# EAGLE schematic test (EAGLE 9.4.2)
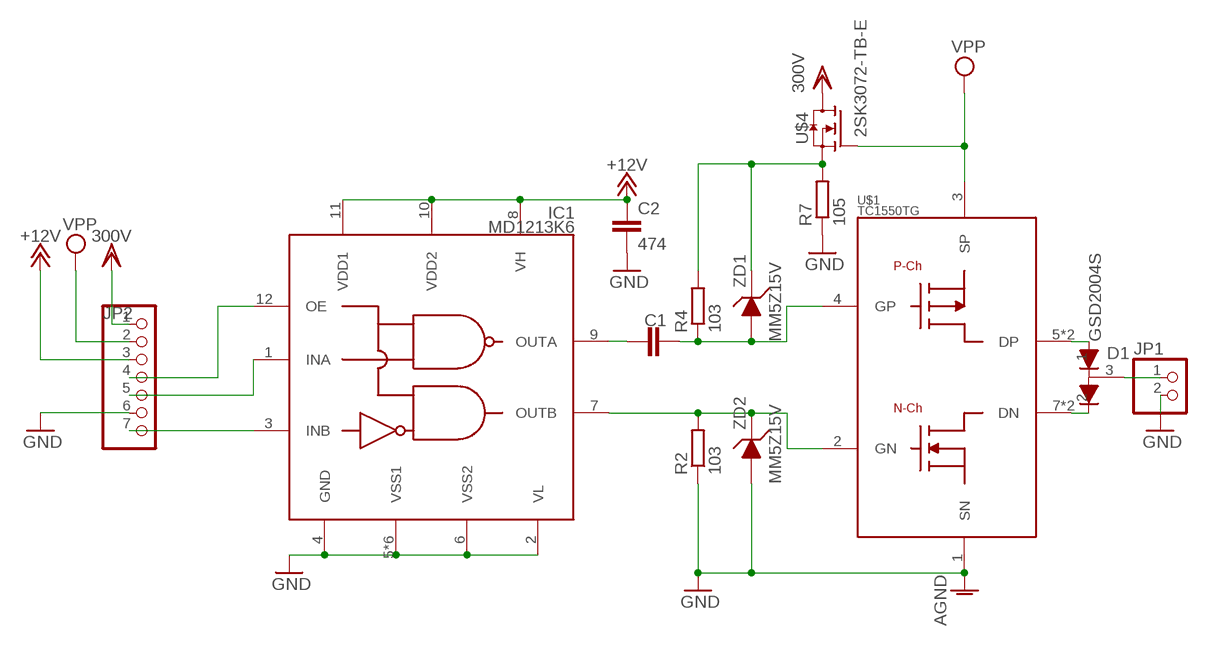
[diagram p0: schematic, sheet 1]

## Parts
C1  C-EUC3216  [C3216]
C2  474  C-EU025-024X044  [C025-024X044]
D1  GSD2004S  [SOT23]
IC1  MD1213K6  [QFN12]
JP1  PINHD-1X2  [1X02]
JP2  PINHD-1X7  [1X07]
R2  103  R-EU_0204/5  [0204/5]
R4  103  R-EU_0204/5  [0204/5]
R7  105  R-EU_0204/5  [0204/5]
U$1  TC1550TG  [SOIC-08LG]
U$4  2SK3072-TB-E  [SOT95P250X120-3]
ZD1  MM5Z15V  [SOD523]
ZD2  MM5Z15V  [SOD523]

## Nets
+12V: C2.1 IC1.8(VH) IC1.10(VDD2) IC1.11(VDD1) JP2.3
GND: C2.2 IC1.2(VL) IC1.4(GND) IC1.5(VSS1) IC1.6(VSS2) IC1.THP(VSS1) IC1.THV$1(VSS1) IC1.THV$2(VSS1) IC1.THV$3(VSS1) IC1.THV$4(VSS1) JP1.2 JP2.6 R2.1 R7.1 U$1.1(SN) ZD2.P$2 ; supply symbol labelled AGND
N$1: IC1.7(OUTB) R2.2 U$1.2(GN) ZD2.P$1(K)
N$2: C1.1 IC1.9(OUTA)
N$3: C1.2 R4.1 U$1.4(GP) ZD1.P$2
N$4: IC1.1(INA) JP2.5
N$5: IC1.12(OE) JP2.4
N$6: R4.2 R7.2 U$4.2(S) ZD1.P$1(K)
N$7: D1.1 U$1.5(DP) U$1.6(DP)
N$8: D1.2 U$1.7(DN) U$1.8(DN)
N$9: D1.3 JP1.1
N$10: IC1.3(INB) JP2.7
VDD: JP2.1 U$4.3(D) ; supply symbol labelled 300V
VPP: JP2.2 U$1.3(SP) U$4.1(G)

## Library data of the parts
C1 C2 = rcl:C-EU: CAPACITOR, European symbol; SPICEPREFIX: C
D1 = Diode_Vishay:GSD2004S: GSD2004S http://www.vishay.com/docs/85728/gsd2004s.pdf
IC1 = md1213:MD1213K6: MD1213K6 One of Supertex (Microchip Tech.) devices. 12-lead package (K6) The thermal pad and vias are connected to VSS1 externally in this library. VSS1 and VSS2 should be at the same potential. VDD1 and VDD2 should also be at the same potential.
JP1 = pinhead:PINHD-1X2: PIN HEADER
JP2 = pinhead:PINHD-1X7: PIN HEADER
R2 R4 R7 = rcl:R-EU_: RESISTOR, European symbol; SPICEPREFIX: R
U$1 = TC1550:TC1550TG: TC1550TG N- and P-Channel Enhancement-Mode Dual MOSFET 8-lead soic (TG) package
U$4 = Transistor-FET:2SK3072-TB-E: 2SK3072 - N-Channel Silicon MOSFET - General-Purpose Switching Device Applications - Produced by SANYO Semiconductor (now part of On Semiconductor) Features - Ultrahigh-speed switching. - Low-voltage drive. Ordering number : ENN7224A
ZD1 ZD2 = fairchild-semic:MM5Z15V: MM5Z Series Produced by Fairchild Semiconductor Zener Diodes